# Altium schematic sheet DM1097_GPIOHDR.SchDoc: =project_title
size Tabloid; CompanyName: Luxonis Holding; Organization: Luxonis Holding; Address1: 1925 Harmony Park Drive; Address2: Westminster, CO; Address3: 80234; Address4: United States; SheetNumber: 11; SheetTotal: 17
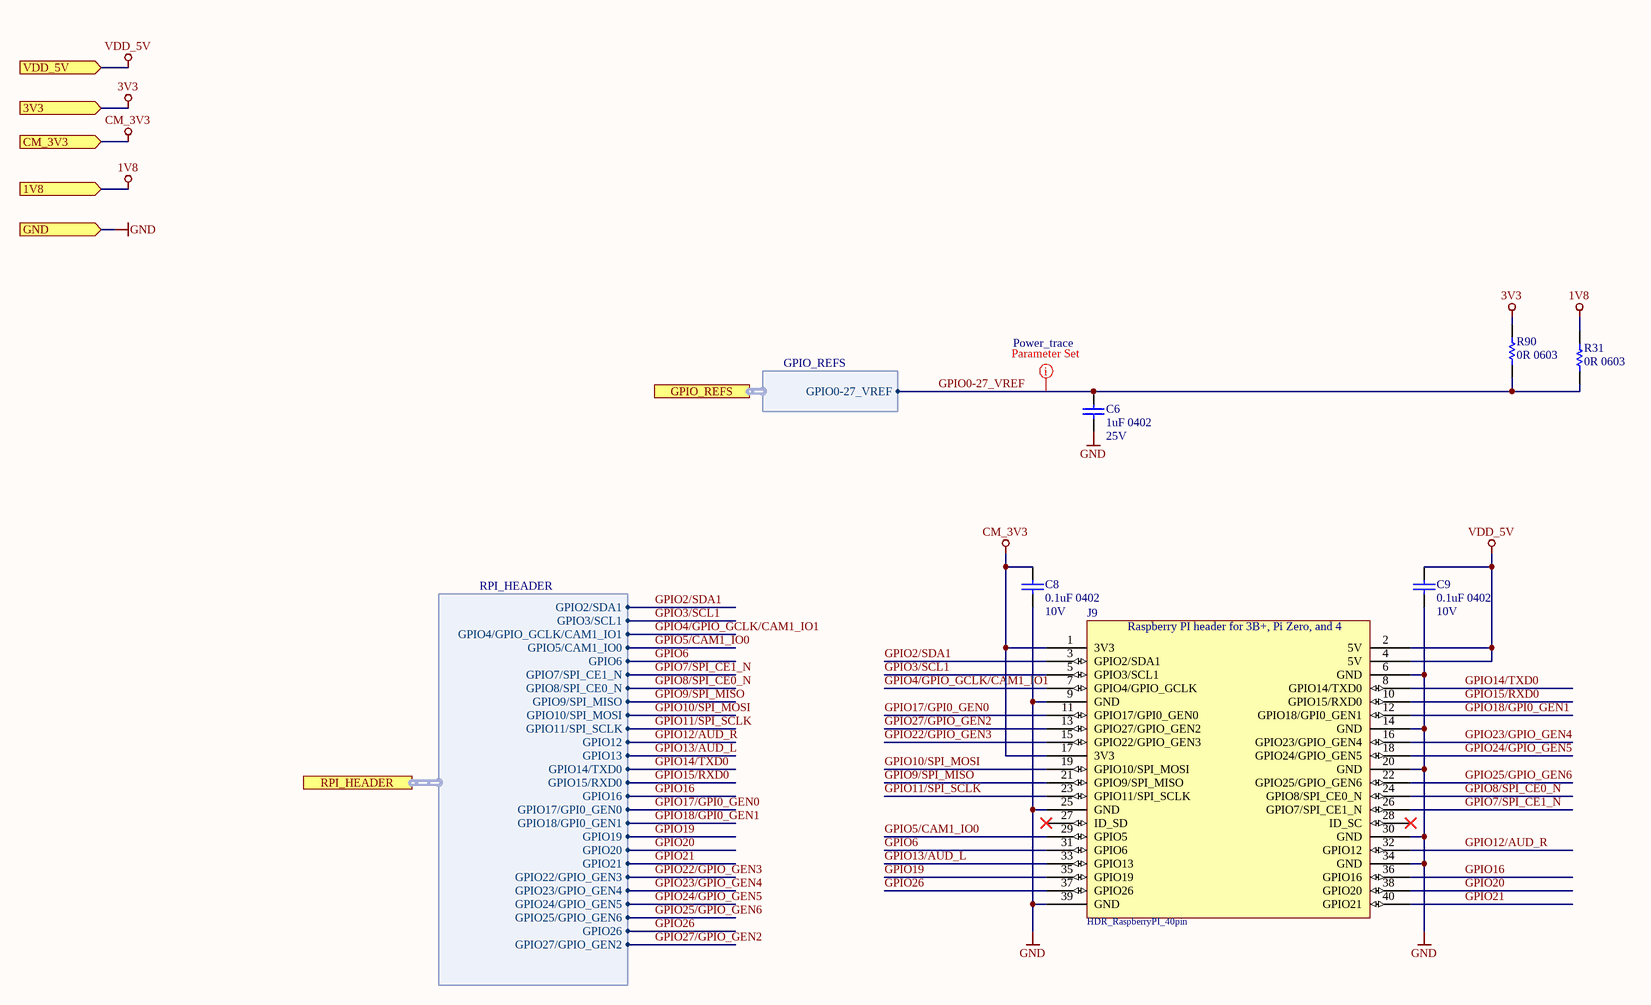
[diagram p0: DM1097_GPIOHDR.SchDoc]

## Parts
C6  1uF 0402  Voltage Rating: 25V  [CAPC0402(1005)70_N]
C8  0.1uF 0402  Voltage Rating: 10V  [CAPC0402(1005)70_N]
C9  0.1uF 0402  Voltage Rating: 10V  [CAPC0402(1005)70_N]
J9  HDR_RaspberryPI_40pin  [61304021121]
R31  0R 0603  [RESC0603(1608)_N]
R90  0R 0603  [RESC0603(1608)_N]

## Ports
1V8 (in), 3V3 (in), CM_3V3 (in), GND (in), GPIO_REFS (harness GPIO_REFS), RPI_HEADER (harness RPI_HEADER), VDD_5V (in)

## Harnesses
GPIO_REFS: GPIO0-27_VREF
RPI_HEADER: GPIO2/SDA1, GPIO3/SCL1, GPIO4/GPIO_GCLK/CAM1_IO1, GPIO5/CAM1_IO0, GPIO6, GPIO7/SPI_CE1_N, GPIO8/SPI_CE0_N, GPIO9/SPI_MISO, GPIO10/SPI_MOSI, GPIO11/SPI_SCLK, GPIO12, GPIO13, GPIO14/TXD0, GPIO15/RXD0, GPIO16, GPIO17/GPI0_GEN0, GPIO18/GPI0_GEN1, GPIO19, GPIO20, GPIO21, GPIO22/GPIO_GEN3, GPIO23/GPIO_GEN4, GPIO24/GPIO_GEN5, GPIO25/GPIO_GEN6, GPIO26, GPIO27/GPIO_GEN2

## Nets
1V8: R31.2 ; port 1V8
3V3: R90.2 ; port 3V3
CM_3V3: C8.2 J9.1(3V3) J9.17(3V3) ; port CM_3V3
GND: C6.1 C8.1 C9.1 J9.6(GND) J9.9(GND) J9.14(GND) J9.20(GND) J9.25(GND) J9.30(GND) J9.34(GND) J9.39(GND) ; port GND
VDD_5V: C9.2 J9.2(5V) J9.4(5V) ; port VDD_5V
GPIO0-27_VREF: C6.2 R31.1 R90.1 ; port GPIO_REFS.GPIO0-27_VREF
GPIO2/SDA1: J9.3(GPIO2/SDA1) ; port RPI_HEADER.GPIO2/SDA1
GPIO3/SCL1: J9.5(GPIO3/SCL1) ; port RPI_HEADER.GPIO3/SCL1
GPIO4/GPIO_GCLK/CAM1_IO1: J9.7(GPIO4/GPIO_GCLK) ; port RPI_HEADER.GPIO4/GPIO_GCLK/CAM1_IO1
GPIO5/CAM1_IO0: J9.29(GPIO5) ; port RPI_HEADER.GPIO5/CAM1_IO0
GPIO6: J9.31(GPIO6) ; port RPI_HEADER.GPIO6
GPIO7/SPI_CE1_N: J9.26(GPIO7/SPI_CE1_N) ; port RPI_HEADER.GPIO7/SPI_CE1_N
GPIO8/SPI_CE0_N: J9.24(GPIO8/SPI_CE0_N) ; port RPI_HEADER.GPIO8/SPI_CE0_N
GPIO9/SPI_MISO: J9.21(GPIO9/SPI_MISO) ; port RPI_HEADER.GPIO9/SPI_MISO
GPIO10/SPI_MOSI: J9.19(GPIO10/SPI_MOSI) ; port RPI_HEADER.GPIO10/SPI_MOSI
GPIO11/SPI_SCLK: J9.23(GPIO11/SPI_SCLK) ; port RPI_HEADER.GPIO11/SPI_SCLK
GPIO12/AUD_R: J9.32(GPIO12) ; port RPI_HEADER.GPIO12
GPIO13/AUD_L: J9.33(GPIO13) ; port RPI_HEADER.GPIO13
GPIO14/TXD0: J9.8(GPIO14/TXD0) ; port RPI_HEADER.GPIO14/TXD0
GPIO15/RXD0: J9.10(GPIO15/RXD0) ; port RPI_HEADER.GPIO15/RXD0
GPIO16: J9.36(GPIO16) ; port RPI_HEADER.GPIO16
GPIO17/GPI0_GEN0: J9.11(GPIO17/GPI0_GEN0) ; port RPI_HEADER.GPIO17/GPI0_GEN0
GPIO18/GPI0_GEN1: J9.12(GPIO18/GPI0_GEN1) ; port RPI_HEADER.GPIO18/GPI0_GEN1
GPIO19: J9.35(GPIO19) ; port RPI_HEADER.GPIO19
GPIO20: J9.38(GPIO20) ; port RPI_HEADER.GPIO20
GPIO21: J9.40(GPIO21) ; port RPI_HEADER.GPIO21
GPIO22/GPIO_GEN3: J9.15(GPIO22/GPIO_GEN3) ; port RPI_HEADER.GPIO22/GPIO_GEN3
GPIO23/GPIO_GEN4: J9.16(GPIO23/GPIO_GEN4) ; port RPI_HEADER.GPIO23/GPIO_GEN4
GPIO24/GPIO_GEN5: J9.18(GPIO24/GPIO_GEN5) ; port RPI_HEADER.GPIO24/GPIO_GEN5
GPIO25/GPIO_GEN6: J9.22(GPIO25/GPIO_GEN6) ; port RPI_HEADER.GPIO25/GPIO_GEN6
GPIO26: J9.37(GPIO26) ; port RPI_HEADER.GPIO26
GPIO27/GPIO_GEN2: J9.13(GPIO27/GPIO_GEN2) ; port RPI_HEADER.GPIO27/GPIO_GEN2

Not connected (* = marked no-connect by the designer): J9 27(ID_SD)* 28(ID_SC)*

## Layout directives
net class Power_trace: GPIO0-27_VREF

## Notes on the sheet
- Title
- Size:
- Date:
- Tabloid
- Number:
- Time:
- Revision:
- Sheet
- of
- Drawn by:
- (in symbol 61304021121_RPI_40pin) Raspberry PI header for 3B+, Pi Zero, and 4

## Library data of the parts
C6 = GRM155R61E105KA12D: CAP CER 1UF 25V X5R 0402 10%; Manufacturer 1: Murata; Material: Ceramic; Manufacturer Part Number 1: GRM155R61E105KA12D; Supplier 1: Digi-Key; Stock 1: 200653; Pricing 1: 1=0.10000, 10=0.07100, 100=0.03350, 500=0.02352, 1000=0.01947, 2500=0.01812, 5000=0.01658 (USD); RoHS: Yes; Mount: Surface Mount; Case/Package: 0402; Weight: 0.000212oz; Case Code (Metric): 1005; Case Code (Imperial): 0402; Min Operating Temperature: -55°C; Max Operating Temperature: 85°C; Tolerance: 10%; Capacitance: 1uF; Dielectric: X5R; Voltage Rating (DC): 25V; Packaging: Tape and Reel; Package Quantity: 10000; Termination: SMD/SMT; Voltage: 25V; Length: 1mm; Height: 0.5mm; Width: 0.5mm; Thickness: 0.022inch; Depth: 0.5mm; Lead Free: Lead Free; REACH SVHC: No SVHC; ComponentLink1URL: https://datasheet.ciiva.com/22732/1666664-22732122.pdf?src-supplier=Element14; ComponentLink1Description: https://datasheet.ciiva.com/22732/1666664-22732122.pdf?src-supplier=Element14; ComponentLink2URL: https://datasheet.ciiva.com/7719/1666664-7719006.pdf?src-supplier=Element14; ComponentLink2Description: https://datasheet.ciiva.com/7719/1666664-7719006.pdf?src-supplier=Element14; Supplier Part Number 1: 490-10017-1-ND; Supplier 2: Arrow; Supplier 3: TTI; Supplier Part Number 2: GRM155R61E105KA12D; Supplier Part Number 3: GRM155R61E105KA12D
C8 C9 = GRM155R71A104JA01D: CAP CER 0.1UF 10V X7R 0402 5%; Manufacturer 1: Murata; Capacitance: 100nF; Manufacturer Part Number 1: GRM155R71A104JA01D; Supplier 1: Digi-Key; Stock 1: 1346709; Pricing 1: 1=0.10000, 10=0.02500, 100=0.01130, 500=0.00806, 1000=0.00633, 2500=0.00575, 5000=0.00529 (USD); RoHS: Yes; Mount: Surface Mount; Case/Package: 0402; Case Code (Imperial): 0402; Case Code (Metric): 1005; Min Operating Temperature: -55°C; Max Operating Temperature: 125°C; Tolerance: 5%; Packaging: Tape and Reel; Voltage Rating (DC): 10V; Dielectric: X7R; Package Quantity: 10000; Termination: SMD/SMT; Length: 1mm; Height: 0.5mm; Width: 0.02inch; Thickness: 0.022inch; Depth: 0.5mm; Radiation Hardening: No; Lead Free: Lead Free; ComponentLink1URL: https://datasheet.ciiva.com/5411/product-5411135.pdf?src-supplier=Mouser; ComponentLink1Description: https://datasheet.ciiva.com/5411/product-5411135.pdf?src-supplier=Mouser; ComponentLink2URL: https://datasheet.ciiva.com/11618/c02e-11618821.pdf?src-supplier=Avnet; ComponentLink2Description: https://datasheet.ciiva.com/11618/c02e-11618821.pdf?src-supplier=Avnet; Supplier Part Number 1: 490-10777-1-ND
J9 = 61304021121_RPI_40pin: CONN HEADER VERT 40POS 2.54MM THT HDR_RaspberryPI_40pin; Manufacturer 1: Wurth Electronics; Manufacturer: Wurth Elektronik; Contact Resistance: 20mOhm; Row Number: Dual; Pin Number: 40; Withstanding Voltage: 500VAC; Gender: Male; Rated Current: 3A; Working Voltage: 250VAC; Connector Type: Male Pin; Row Spacing: 0.1inch; Manufacturer Part Number 1: 61304021121; Operating Temperature: -40to105degC; Manufacturer URL: http://www.we-online.de; Orientation: Vertical; Pitch: 2.54mm; Datasheet URL: https://katalog.we-online.de/em/datasheet/6130xx21121.pdf; Package Reference: 61304021121; Part Number: 61304021121; Packaging: Bag; Mounting Technology: THT; Publisher: WurthElektronik; Supplier 1: Digi-Key; Stock 1: 969; Pricing 1: 1=1.89000, 10=1.60200, 25=1.33520, 50=1.11300, 100=1.01200, 500=0.92000 (USD); RoHS: Yes; Mount: Through Hole; Contact Plating: Gold; Contact Material: Copper; Color: Black; Number of Rows: 2; Number of Positions: 40; Termination: Solder; Number of Contacts: 40; Contact Mating Length: 0.236inch; REACH SVHC: Unknown; ComponentLink1URL: http://www.farnell.com/datasheets/1442180.pdf?src-supplier=Farnell; ComponentLink1Description: http://www.farnell.com/datasheets/1442180.pdf?src-supplier=Farnell; ComponentLink2URL: http://www.farnell.com/datasheets/1442180.pdf?src-supplier=Element14; ComponentLink2Description: http://www.farnell.com/datasheets/1442180.pdf?src-supplier=Element14; ComponentLink3URL: http://www.farnell.com/datasheets/1442180.pdf?src-supplier=Newark; ComponentLink3Description: http://www.farnell.com/datasheets/1442180.pdf?src-supplier=Newark; ComponentLink4URL: https://katalog.we-online.de/em/datasheet/6130xx21121.pdf?src-supplier=Digi-Key; ComponentLink4Description: https://katalog.we-online.de/em/datasheet/6130xx21121.pdf?src-supplier=Digi-Key; Supplier Part Number 1: 732-5310-ND; Supplier 2: Newark; Supplier 3: Mouser; Supplier 4: Farnell; Supplier 5: Element14; Supplier Part Number 2: 20X1011; Supplier Part Number 3: 710-61304021121; Supplier Part Number 4: 2356148; Supplier Part Number 5: 2356148
R31 R90 = CRCW06030000Z0EA: RES SMD 0 OHM JUMPER 1/10W 0603 0 Ohms Jumper 0.1W, 1/10W Chip Resistor 0603 (1608 Metric) Automotive AEC-Q200 Thick Film; Manufacturer 1: Vishay; Manufacturer Part Number 1: CRCW0603-0000Z0EA; Resistance: 0mR; Power Rating: 100mW; Voltage Rating: 75V; Temperature Coefficient: 100ppm/°C; Tolerance: 5%; Current Rating: 2A; Supplier 1: Digi-Key; Stock 1: 742743; Pricing 1: 1=0.100000, 10=0.034000, 25=0.024400, 50=0.018600, 100=0.013800, 250=0.010480, 500=0.008400, 1000=0.006180 (USD); RoHS: Yes; Mount: Surface Mount; Case/Package: 0603; Weight: 7.1E-05oz; Contact Plating: Tin,Lead; Case Code (Metric): 1608; Case Code (Imperial): 0603; Min Operating Temperature: -55°C; Max Operating Temperature: 155°C; Composition: Thick Film; Termination: SMD/SMT; Packaging: Tape and Reel; Package Quantity: 1; Number of Terminations: 2; Military Standard: Not; Max Power Dissipation: 100mW; Voltage Rating (DC): 75V; Features: Automotive AEC-Q200; Working Voltage: 75V; Length: 1.55mm; Height: 0.02inch; Width: 0.033inch; Depth: 0.85mm; Radiation Hardening: No; Lead Free: Lead Free; REACH SVHC: Unknown; ComponentLink1URL: https://datasheet.ciiva.com/2461/dcrcwe3-2461968.pdf?src-supplier=Digi-Key; ComponentLink1Description: https://datasheet.ciiva.com/2461/dcrcwe3-2461968.pdf?src-supplier=Digi-Key; ComponentLink2URL: https://datasheet.ciiva.com/2461/dcrcwe3-2461969.pdf?src-supplier=Digi-Key; ComponentLink2Description: https://datasheet.ciiva.com/2461/dcrcwe3-2461969.pdf?src-supplier=Digi-Key; ComponentLink3URL: https://datasheet.ciiva.com/2461/dcrcwe3-2461970.pdf?src-supplier=Digi-Key; ComponentLink3Description: https://datasheet.ciiva.com/2461/dcrcwe3-2461970.pdf?src-supplier=Digi-Key; ComponentLink4URL: https://datasheet.ciiva.com/8340/dcrcwe3-8340197.pdf?src-supplier=Avnet; ComponentLink4Description: https://datasheet.ciiva.com/8340/dcrcwe3-8340197.pdf?src-supplier=Avnet; ComponentLink5URL: https://datasheet.ciiva.com/16941/dcrcw-16941302.pdf?src-supplier=Avnet+Europe; ComponentLink5Description: https://datasheet.ciiva.com/16941/dcrcw-16941302.pdf?src-supplier=Avnet+Europe; ComponentLink6URL: https://datasheet.ciiva.com/16199/dcrcwe3-16199063.pdf?src-supplier=Future+Electronics; ComponentLink6Description: https://datasheet.ciiva.com/16199/dcrcwe3-16199063.pdf?src-supplier=Future+Electronics; ComponentLink7URL: https://datasheet.ciiva.com/16725/70201119-16725175.pdf?src-supplier=Allied+Electronics; ComponentLink7Description: https://datasheet.ciiva.com/16725/70201119-16725175.pdf?src-supplier=Allied+Electronics; ComponentLink8URL: https://datasheet.ciiva.com/26316/fld-crcw-e3-data-en-26316615.pdf?src-supplier=Distrelec; ComponentLink8Description: https://datasheet.ciiva.com/26316/fld-crcw-e3-data-en-26316615.pdf?src-supplier=Distrelec; ComponentLink9URL: https://datasheet.ciiva.com/5544/dcrcwe3-109170-5544344.pdf?src-supplier=Mouser; ComponentLink9Description: https://datasheet.ciiva.com/5544/dcrcwe3-109170-5544344.pdf?src-supplier=Mouser; ComponentLink10URL: https://datasheet.ciiva.com/7841/1720486-7841816.pdf?src-supplier=Element14; ComponentLink10Description: https://datasheet.ciiva.com/7841/1720486-7841816.pdf?src-supplier=Element14; ComponentLink11URL: https://datasheet.ciiva.com/7841/1720486-7841817.pdf?src-supplier=Element14; ComponentLink11Description: https://datasheet.ciiva.com/7841/1720486-7841817.pdf?src-supplier=Element14; ComponentLink12URL: https://datasheet.ciiva.com/7841/125364-7841818.pdf?src-supplier=Element14; ComponentLink12Description: https://datasheet.ciiva.com/7841/125364-7841818.pdf?src-supplier=Element14; ComponentLink13URL: https://datasheet.ciiva.com/16721/70201119-16721450.pdf?src-supplier=Allied+Electronics; ComponentLink13Description: https://datasheet.ciiva.com/16721/70201119-16721450.pdf?src-supplier=Allied+Electronics; Supplier Part Number 1: 541-0.0GCT-ND